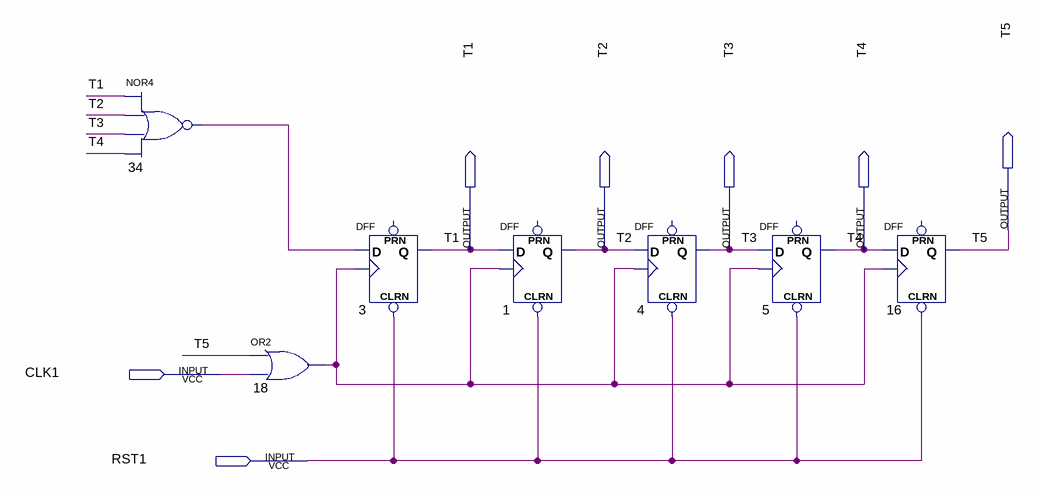
[diagram p0: schematic sheet]
// Quartus schematic prj04.bdf as structural Verilog: 7 symbols, 7 pins
module prj04 (
  input  CLK1,
  input  RST1,
  output T5,
  output T1,
  output T2,
  output T3,
  output T4
);

  wire n18_out, n34_out;

  nor u_34 (n34_out, T1, T2, T3, T4);
  or u_18 (n18_out, T5, CLK1);
  DFF u_3 (.CLRN(RST1), .CLK(n18_out), .D(n34_out), .Q(T1));  // open: PRN
  DFF u_1 (.CLRN(RST1), .CLK(n18_out), .D(T1), .Q(T2));  // open: PRN
  DFF u_4 (.CLRN(RST1), .CLK(n18_out), .D(T2), .Q(T3));  // open: PRN
  DFF u_5 (.CLRN(RST1), .CLK(n18_out), .D(T3), .Q(T4));  // open: PRN
  DFF u_16 (.CLRN(RST1), .CLK(n18_out), .D(T4), .Q(T5));  // open: PRN
endmodule
